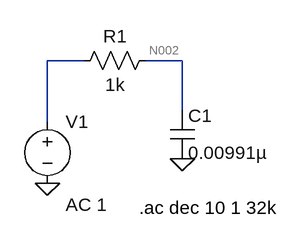
[diagram p0: schematic AC.asc]
AC.asc, the LTspice schematic file:
Version 4
SHEET 1 880 680
WIRE 144 64 96 64
WIRE 272 64 224 64
WIRE 272 128 272 64
WIRE 96 144 96 64
FLAG 96 224 0
FLAG 272 192 0
SYMBOL voltage 96 128 R0
WINDOW 123 24 124 Left 2
WINDOW 39 0 0 Left 2
SYMATTR Value2 AC 1
SYMATTR InstName V1
SYMATTR Value ""
SYMBOL cap 256 128 R0
SYMATTR InstName C1
SYMATTR Value 0.00991µ
SYMBOL res 240 48 R90
WINDOW 0 0 56 VBottom 2
WINDOW 3 32 56 VTop 2
SYMATTR InstName R1
SYMATTR Value 1k
TEXT 216 256 Left 2 !.ac dec 10 1 32k

The netlist it stands for:
* AC.asc
V1 N001 0 AC 1
C1 N002 0 0.00991µ
R1 N002 N001 1k
.ac dec 10 1 32k
.backanno
.end

* Results of the author's LTspice run, read from the files saved beside the schematic
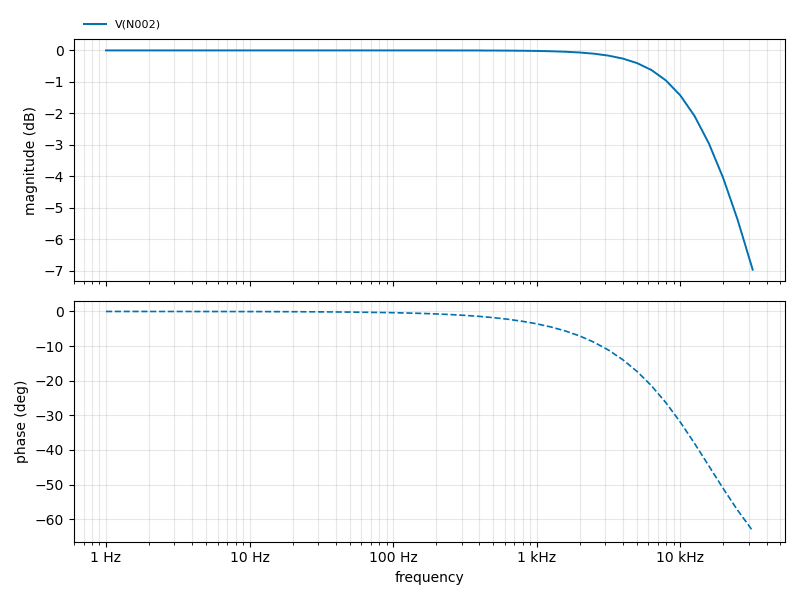
[diagram p1: AC Analysis of AC.asc, plotted from the saved traces]
* AC Analysis, 1 run:
*   V(N002): -0.00 dB at 1 Hz, -6.96 dB at 32 kHz, peak -0.00 dB at 1 Hz, 3 dB below the peak at 16.04 kHz